# Altium project MSP Breakout Board.PrjPcb
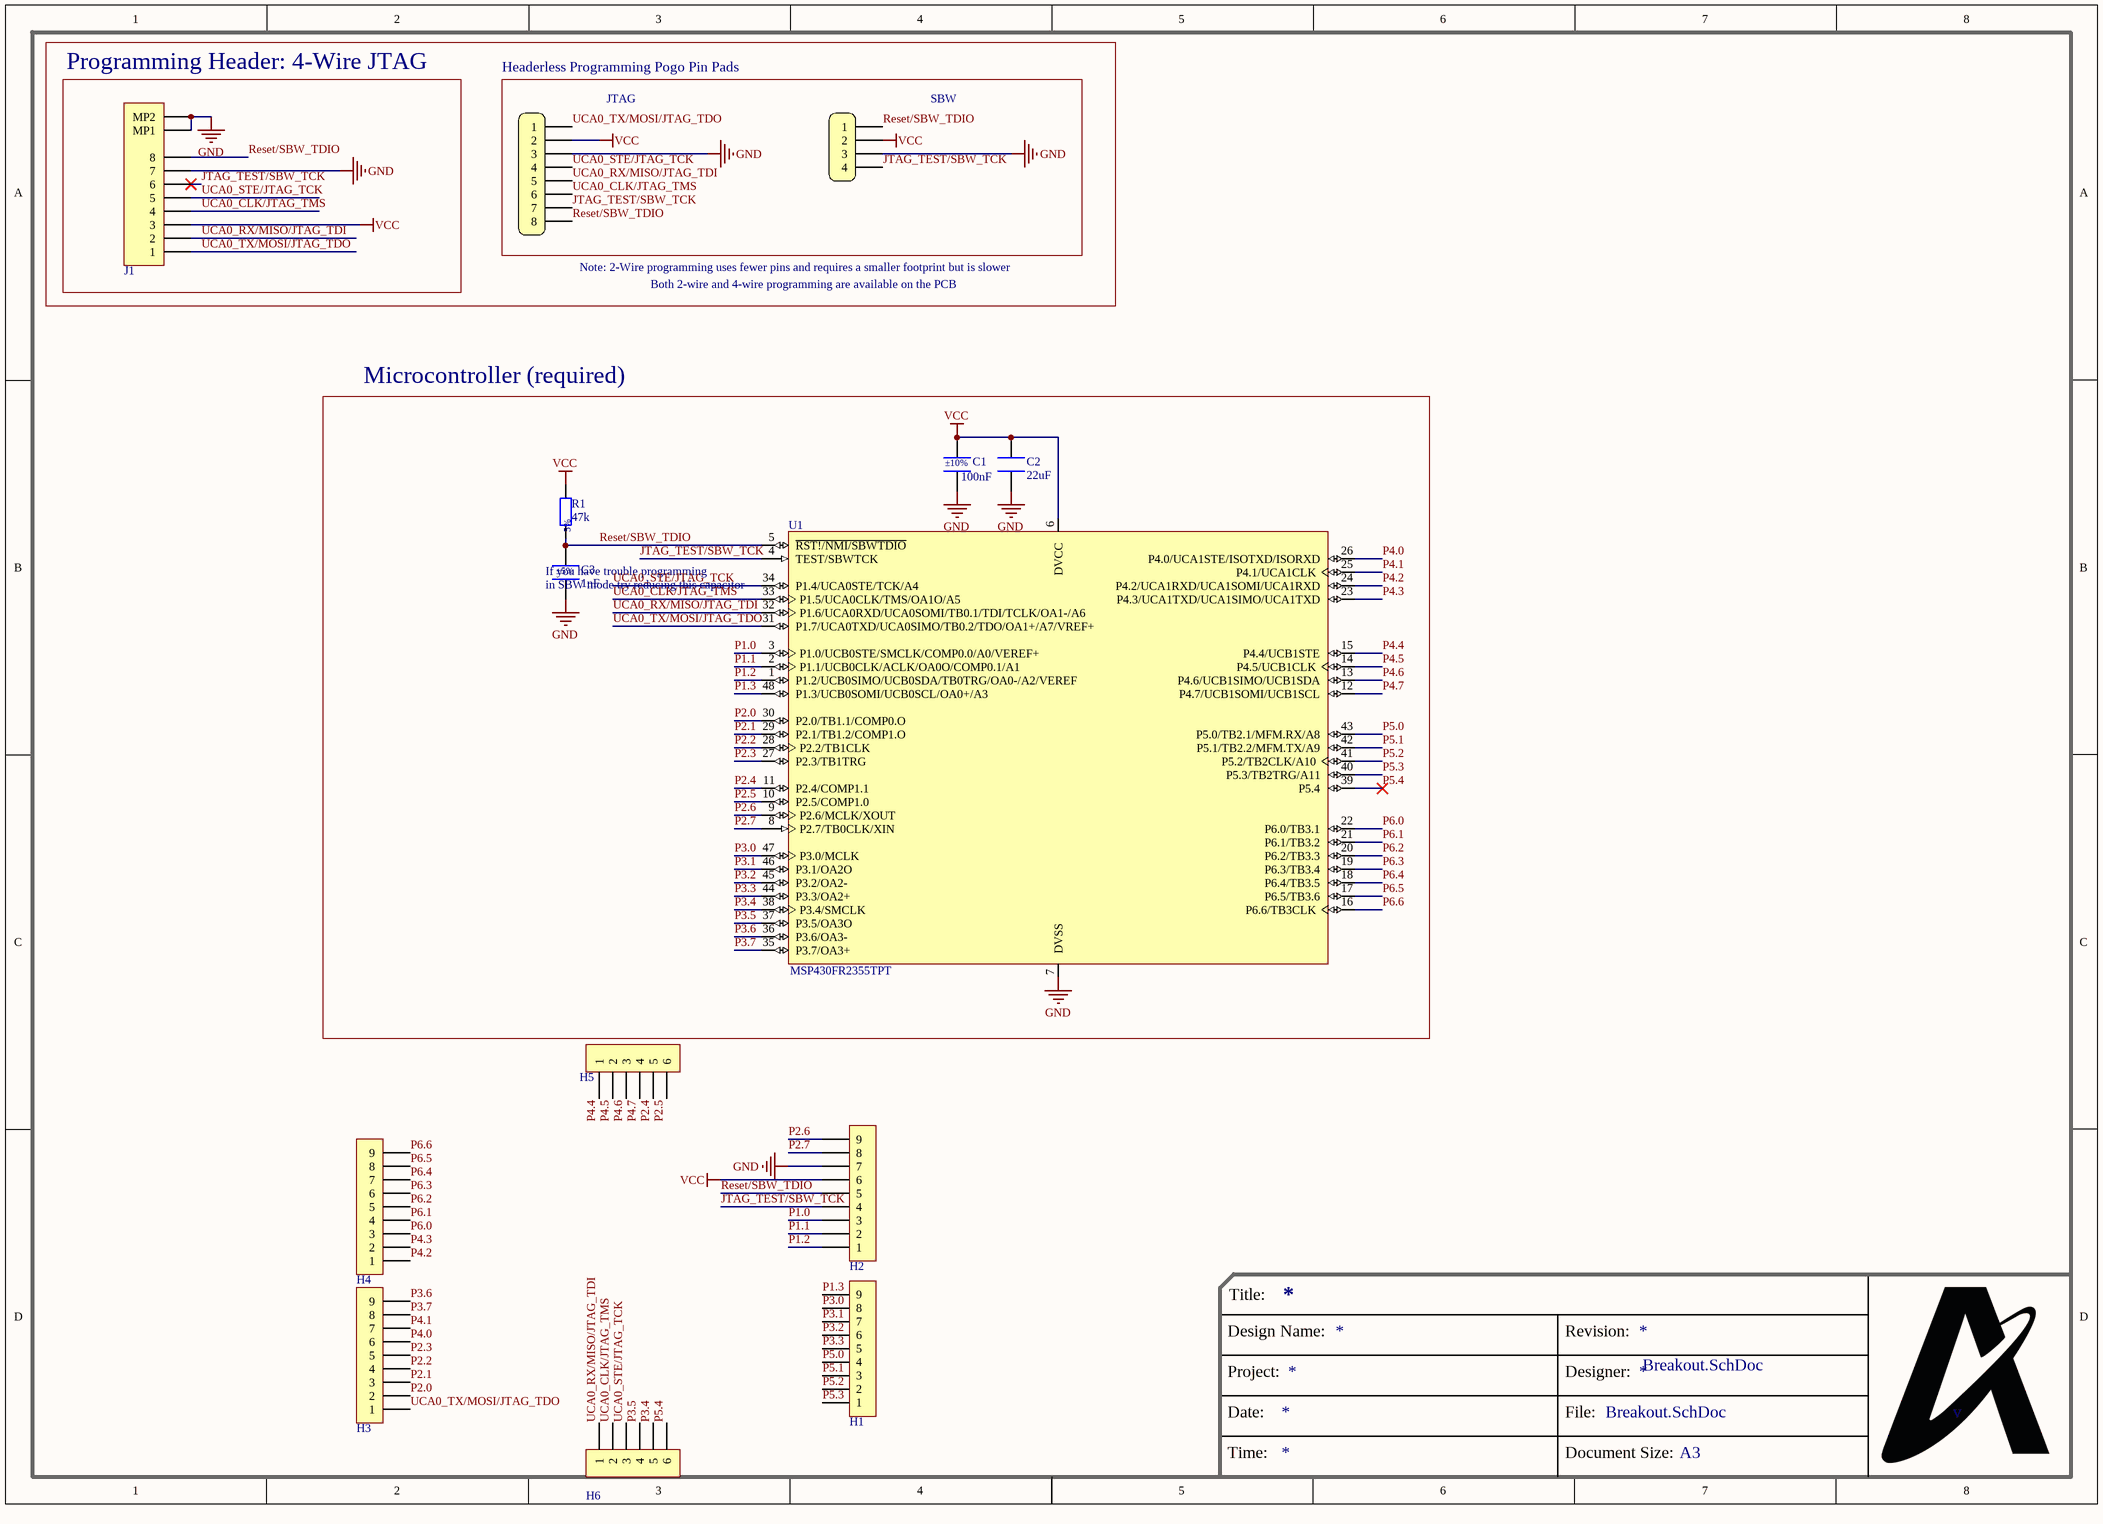
[diagram p0: Breakout.SchDoc]
1 sheet, 14 parts. Net scope: global (net labels, ports and power ports of the same name join across sheets).
Board file: Breakout.PcbDoc

## Sheet Breakout.SchDoc
size A3; PageSetup: Record=PageOptions|CenterHorizontal=True|CenterVertical=True|PrintScale=0.97|XCorrection=1.00|YCorrection=1.00|PrintKind=0|BorderSize=5000000|LeftOffset=0|BottomOffset=0|Orientation=2|PaperLength=1000|PaperWidth=1000|Scale=100|PaperSource=7|PrintQuality=-4|MediaType=1|DitherType=10|PaperKind=A4|PrintScaleMode=1; SheetNumber: 1; SheetTotal: 1

### Parts
C1  100nF  [CAPACITOR_0805_2012M-70N]
C2  22uF  [CAPACITOR_0805_2012M-70N]
C3  1nF  [CAPACITOR_0805_2012M-70N]
H1  HDR,2.54mm,1x9  [HEADER_2.54MM_1x9PIN]  (value not drawn)  (no BOM)
H2  HDR,2.54mm,1x9  [HEADER_2.54MM_1x9PIN]  (value not drawn)  (no BOM)
H3  HDR,2.54mm,1x9  [HEADER_2.54MM_1x9PIN]  (value not drawn)  (no BOM)
H4  HDR,2.54mm,1x9  [HEADER_2.54MM_1x9PIN]  (value not drawn)  (no BOM)
H5  HDR,2.54mm,1x6  [HEADER_2.54MM_1x6PIN]  (value not drawn)  (no BOM)
H6  HDR,2.54mm,1x6  [HEADER_2.54MM_1x6PIN]  (value not drawn)  (no BOM)
H*  Headerless Pogo Holes 4-pin  [POGO_4_PIN_HEADER]  (value not drawn)  (no BOM)
J1  5015680807  [MOLEX_5015680807]  (value not drawn)
PP2  Headerless Pogo Holes 8-pin  [POGO_8_PIN_HEADER]  (value not drawn)  (no BOM)
R1  47k  [Resistor_0805_2012M-50N]
U1  MSP430FR2355TPT  [LQFP_PT_48_N]

### Blocks framed on the sheet
Programming Header: 4-Wire JTAG: J1
Headerless Programming Pogo Pin Pads: H* PP2
Microcontroller (required): C1-C3 R1 U1

### Nets
GND: C1.1 C2.1 C3.1 H2.7 H*.3 J1.7 J1.MP1 J1.MP2 PP2.3 U1.7(DVSS)
VCC: C1.2 C2.2 H2.6 H*.2 J1.3 PP2.2 R1.2 U1.6(DVCC)
JTAG_TEST/SBW_TCK: H2.4 H*.4 J1.6 PP2.7 U1.4(TEST/SBWTCK)
P1.0: H2.3 U1.3(P1.0/UCB0STE/SMCLK/COMP0.0/A0/VEREF+)
P1.1: H2.2 U1.2(P1.1/UCB0CLK/ACLK/OA0O/COMP0.1/A1)
P1.2: H2.1 U1.1(P1.2/UCB0SIMO/UCB0SDA/TB0TRG/OA0-/A2/VEREF)
P1.3: H1.9 U1.48(P1.3/UCB0SOMI/UCB0SCL/OA0+/A3)
P2.0: H3.2 U1.30(P2.0/TB1.1/COMP0.O)
P2.1: H3.3 U1.29(P2.1/TB1.2/COMP1.O)
P2.2: H3.4 U1.28(P2.2/TB1CLK)
P2.3: H3.5 U1.27(P2.3/TB1TRG)
P2.4: H5.5 U1.11(P2.4/COMP1.1)
P2.5: H5.6 U1.10(P2.5/COMP1.0)
P2.6: H2.9 U1.9(P2.6/MCLK/XOUT)
P2.7: H2.8 U1.8(P2.7/TB0CLK/XIN)
P3.0: H1.8 U1.47(P3.0/MCLK)
P3.1: H1.7 U1.46(P3.1/OA2O)
P3.2: H1.6 U1.45(P3.2/OA2-)
P3.3: H1.5 U1.44(P3.3/OA2+)
P3.4: H6.5 U1.38(P3.4/SMCLK)
P3.5: H6.4 U1.37(P3.5/OA3O)
P3.6: H3.9 U1.36(P3.6/OA3-)
P3.7: H3.8 U1.35(P3.7/OA3+)
P4.0: H3.6 U1.26(P4.0/UCA1STE/ISOTXD/ISORXD)
P4.1: H3.7 U1.25(P4.1/UCA1CLK)
P4.2: H4.1 U1.24(P4.2/UCA1RXD/UCA1SOMI/UCA1RXD)
P4.3: H4.2 U1.23(P4.3/UCA1TXD/UCA1SIMO/UCA1TXD)
P4.4: H5.1 U1.15(P4.4/UCB1STE)
P4.5: H5.2 U1.14(P4.5/UCB1CLK)
P4.6: H5.3 U1.13(P4.6/UCB1SIMO/UCB1SDA)
P4.7: H5.4 U1.12(P4.7/UCB1SOMI/UCB1SCL)
P5.0: H1.4 U1.43(P5.0/TB2.1/MFM.RX/A8)
P5.1: H1.3 U1.42(P5.1/TB2.2/MFM.TX/A9)
P5.2: H1.2 U1.41(P5.2/TB2CLK/A10)
P5.3: H1.1 U1.40(P5.3/TB2TRG/A11)
P5.4: H6.6 U1.39(P5.4)
P6.0: H4.3 U1.22(P6.0/TB3.1)
P6.1: H4.4 U1.21(P6.1/TB3.2)
P6.2: H4.5 U1.20(P6.2/TB3.3)
P6.3: H4.6 U1.19(P6.3/TB3.4)
P6.4: H4.7 U1.18(P6.4/TB3.5)
P6.5: H4.8 U1.17(P6.5/TB3.6)
P6.6: H4.9 U1.16(P6.6/TB3CLK)
Reset/SBW_TDIO: C3.2 H2.5 H*.1 J1.8 PP2.8 R1.1 U1.5(~{RST!/NMI/SBWTDIO})
UCA0_CLK/JTAG_TMS: H6.2 J1.4 PP2.6 U1.33(P1.5/UCA0CLK/TMS/OA1O/A5)
UCA0_RX/MISO/JTAG_TDI: H6.1 J1.2 PP2.5 U1.32(P1.6/UCA0RXD/UCA0SOMI/TB0.1/TDI/TCLK/OA1-/A6)
UCA0_STE/JTAG_TCK: H6.3 J1.5 PP2.4 U1.34(P1.4/UCA0STE/TCK/A4)
UCA0_TX/MOSI/JTAG_TDO: H3.1 J1.1 PP2.1 U1.31(P1.7/UCA0TXD/UCA0SIMO/TB0.2/TDO/OA1+/A7/VREF+)

### Notes on the sheet
- JTAG
- SBW
- (near PP2) Note: 2-Wire programming uses fewer pins and requires a smaller footprint but is slower
- Both 2-wire and 4-wire programming are available on the PCB
- (near C3) If you have trouble programming
- (near C3) in SBW mode try reducing this capacitor
- v
- Title:
- Design Name:
- Project:
- Revision:
- Designer:
- Date:
- Time:
- File:
- Document Size:
- A3

### Library data of the parts
C1 = Generic Capacitor: MF Part No.: C0805C104K5RAC7800; Tolerance: ±10%; Temperature Coefficient: X7R; Rated Voltage: 50V; Capacitance at Rated Voltage: 40%; Temp Range: -55°C ~ 125°C; Supplier 1: Digikey; Supplier 1 Part No.: 399-C0805C104K5RAC7800CT-ND; Package: 0805; Value: 100nF
C2 = C0805C226M9PACTU: Passive - Capacitor, X5R, 22uF Max, 6.3V, 0805 (2012 Metric), ±20%, -55°C ~ 85°C. 8.8uF @ 5V; APSS Standard Part: APSS Standard; Capacitance at Rated Voltage: 30%; Tolerance: ±20%; Temperature Coefficient: X5R; Rated Voltage: 6.3V; Temp Range: -55°C ~ 85°C; Package: 0402; Supplier 1: Digikey; Supplier 1 Part No.: 399-C0805C226M9PAC7800CT-ND; MF Part No.: C0805C226M9PACTU; Value: 22uF
C3 = Generic Capacitor: MF Part No.: 399-C0805C102J5GAC7800CT-ND; Tolerance: ±5%; Temperature Coefficient: X7R; Rated Voltage: 50V; Capacitance at Rated Voltage: 100%; Temp Range: -55°C ~ 125°C; Supplier 1: Digikey; Supplier 1 Part No.: 399-C0805C102J5GAC7800CT-ND; Package: 0805; Value: 1nF
H1-H4 = HDR,2.54mm,1x9: Connector - 2.54mm, 1x9-pin
H5 H6 = HDR,2.54mm,1x6: Connector - 2.54mm, 1x6-pin
H* = Headerless Pogo Holes 4-pin: Connector - Pogo pin pads, 4-pin
J1 = 5015680807: Connector - Picoclasp  08-pin, SMT, RA; APSS Standard Part: APSS Standard; Pitch: 1mm; Mounting Type: Surface Mount; Orientation: Straight; MF Part No.: 5015680807; Pins: 8; Supplier 1: Digikey
PP2 = Headerless Pogo Holes 8-pin: Connector - Pogo pin pads, 8-pin
R1 = RMCF0805JT Series: Passive - Resistor Series, 0805, 5%, 100m - 22M, E24, 0.063W, 1/16W, ±200ppm/°C, -55°C ~ 155°C, 0805 (2012 Metric); MF Part No.: RMCF0805JT47K0; APSS Standard Part: APSS Standard; Power: 1/8W; Value Range: 100m ~ 22M; Rated Voltage: 150V; Tolerance: 5%; E Series: E24; Temp Range: -55°C ~ 155°C; Supplier 1: Digikey; Package: 0805; Temperature Coefficient: ±200ppm/°C; Value: 47k
U1 = MSP430FR2355TPT: IC - Microcontroller, LQFP-48, 24MHz, 32KB FRAM, Op-Amps/PGAs, 12-bit DACs, 12-bit ADC, -40 to 105C; APSS Standard Part: APSS Standard; Temp Range: -40°C ~ 105°C; Rated Voltage: 3.6V; MF Part No.: MSP430FR2355TPT; Package: LQFP-48; Supplier 1: Digikey; Supplier 1 Part No.: 296-50260-ND